# Altium schematic sheet ADCs.SchDoc: =ProjectTitle
size A3; Author: Jaime I. Chait; Organization: NWES LLC; Address1: 111 SW 5th Ave, STE 3150; Address2: Portland, OR 97204; SheetNumber: 1; SheetTotal: 1
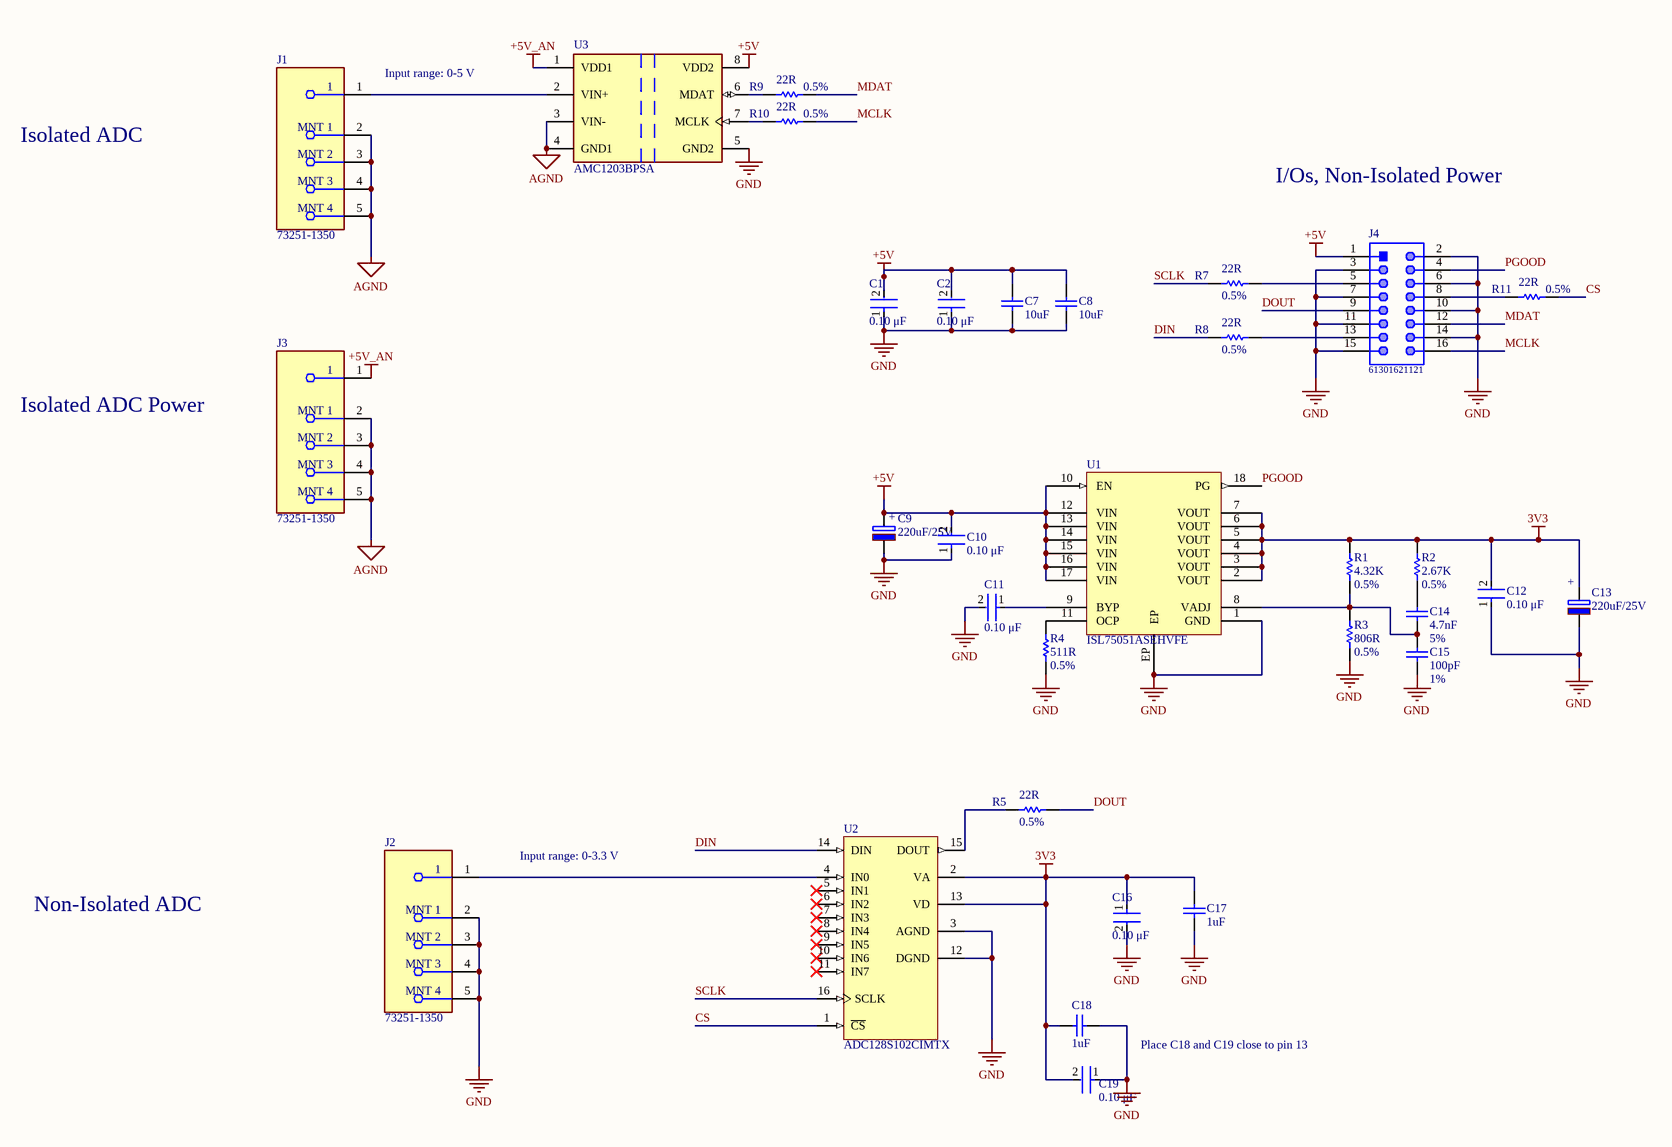
[diagram p0: ADCs.SchDoc]

## Parts
C1  0.10 μF  [FP-C0603C-CF-MFG]
C2  0.10 μF  [FP-C0603C-CF-MFG]
C7  10uF  [CAPC1608X90N]
C8  10uF  [CAPC1608X90N]
C9  220uF/25V  [CAP_AE830X1050N]
C10  0.10 μF  [FP-C0603C-CF-MFG]
C11  0.10 μF  [FP-C0603C-CF-MFG]
C12  0.10 μF  [FP-C0603C-CF-MFG]
C13  220uF/25V  [CAP_AE830X1050N]
C14  4.7nF  Tolerance: 5%  [CAPC1608X90N]
C15  100pF  Tolerance: 1%  [CAPC1608X90N]
C16  0.10 μF  [FP-C0603C-CF-MFG]
C17  1uF  [CAPC1608X90N]
C18  1uF  [CAPC1608X90N]
C19  0.10 μF  [FP-C0603C-CF-MFG]
J1  73251-1350  [FP-73251-1350-MFG]
J2  73251-1350  [FP-73251-1350-MFG]
J3  73251-1350  [FP-73251-1350-MFG]
J4  61301621121  [61301621121]
R1  4.32K  Tolerance: 0.5%  [RESC1608X55N]
R2  2.67K  Tolerance: 0.5%  [RESC1608X55N]
R3  806R  Tolerance: 0.5%  [RESC1608X55N]
R4  511R  Tolerance: 0.5%  [RESC1608X55N]
R5  22R  Tolerance: 0.5%  [RESC1608X55N]
R7  22R  Tolerance: 0.5%  [RESC1608X55N]
R8  22R  Tolerance: 0.5%  [RESC1608X55N]
R9  22R  Tolerance: 0.5%  [RESC1608X55N]
R10  22R  Tolerance: 0.5%  [RESC1608X55N]
R11  22R  Tolerance: 0.5%  [RESC1608X55N]
U1  ISL75051ASEHVFE  [CFP102P1520X310-18AN]
U2  ADC128S102CIMTX  [MTC16_N]
U3  AMC1203BPSA  [FP-PSA0008A-IPC_C]

## Nets
3V3: C12.2 C13.1 C16.1 C17.1 C18.2 C19.2 R1.2 R2.2 U1.2(VOUT) U1.3(VOUT) U1.4(VOUT) U1.5(VOUT) U1.6(VOUT) U1.7(VOUT) U2.2(VA) U2.13(VD)
+5V: C1.2 C2.2 C7.1 C8.1 C9.1 C10.2 J4.1 U1.10(EN) U1.12(VIN) U1.13(VIN) U1.14(VIN) U1.15(VIN) U1.16(VIN) U1.17(VIN) U3.8(VDD2)
+5V_AN: J3.1 U3.1(VDD1)
AGND: J1.2(MNT_1) J1.3(MNT_2) J1.4(MNT_3) J1.5(MNT_4) J3.2(MNT_1) J3.3(MNT_2) J3.4(MNT_3) J3.5(MNT_4) U3.3(VIN-) U3.4(GND1)
GND: C1.1 C2.1 C7.2 C8.2 C9.2 C10.1 C11.2 C12.1 C13.2 C15.2 C16.2 C17.2 C18.1 C19.1 J2.2(MNT_1) J2.3(MNT_2) J2.4(MNT_3) J2.5(MNT_4) J4.2 J4.3 J4.6 J4.7 J4.10 J4.11 J4.14 J4.15 R3.1 R4.1 U1.1(GND) U1.EP U2.3(AGND) U2.12(DGND) U3.5(GND2)
CS: R11.2 U2.1(~{CS})
DIN: R8.1 U2.14(DIN)
DOUT: J4.9 R5.2
MCLK: J4.16 R10.2
MDAT: J4.12 R9.2
PGOOD: J4.4 U1.18(PG)
SCLK: R7.1 U2.16(SCLK)
NetC11_1: C11.1 U1.9(BYP)
NetC14_1: C14.1 R2.1
NetC14_2: C14.2 C15.1 R1.1 R3.2 U1.8(VADJ)
NetJ1_1: J1.1 U3.2(VIN+)
NetJ2_1: J2.1 U2.4(IN0)
NetJ4_5: J4.5 R7.2
NetJ4_8: J4.8 R11.1
NetJ4_13: J4.13 R8.2
NetR4_2: R4.2 U1.11(OCP)
NetR5_1: R5.1 U2.15(DOUT)
NetR9_1: R9.1 U3.6(MDAT)
NetR10_1: R10.1 U3.7(MCLK)

Not connected (* = marked no-connect by the designer): U2 5(IN1)* 6(IN2)* 7(IN3)* 8(IN4)* 9(IN5)* 10(IN6)* 11(IN7)*

## Notes on the sheet
- (near J1) Input range: 0-5 V
- Isolated ADC
- I/Os, Non-Isolated Power
- Isolated ADC Power
- Non-Isolated ADC
- Input range: 0-3.3 V
- Place C18 and C19 close to pin 13
- Title
- Size:
- Date:
- A4
- Number:
- Time:
- Revision:
- Sheet
- of
- File:
- (in symbol CAP ALUM 220UF 20% 25V SMD) +

## Library data of the parts
C1 C2 C10-C12 C16 C19 = CMP-2006-03056-2: CAP CER 0.1UF 50V 5% X7R 0603; Manufacturer Part Number: C0603C104J5RACTU; Manufacturer: KEMET; Tolerance: 0.05; Automotive Grade: Grade 1; Material: Ceramic; Temperature Coefficient: 30ppm/°C; Value: 0.10 μF; Package: C0603C-CF; Height: 0.87mm; ComponentLink2Description: Datasheet; Voltage Rating: 50 V; Digikey Description: CAP CER 0.1UF 50V 5% X7R 0603; Temperature Range High: +125°C; Device Class L2: Capacitors; Capacitance: 0.10 μF; Octopart: https://octopart.com/c0603c104j5ractu-kemet-10440638; RoHS: TRUE; Mouser Description: Multilayer Ceramic Capacitors MLCC - SMD/SMT 50volts 0.1uF X7R 5%; Temperature Range Low: -55°C; Automotive: Yes; Lead Free: Yes; ComponentLink2URL: https://api.kemet.com/component-edge/download/datasheet/C0603C100J5GACAUTO.pdf; Device Class L3: Ceramic Capacitors; Category: Cap; Temperature: -55°C to +125°C; Temperature Characteristic: X7R; Device Class L1: Passive Components
C7 C8 = CAP CER 10UF 25V X5R 0603: Manufacturer Part Number: GRM188R61E106KA73D; Manufacturer: Murata Electronics; Tolerance: ±10%; Supplier Part Number 1: 490-18214-1-ND; Package: 0603; value: 10uF; Supplier 1: Digi-Key; Height: 1mm; ComponentLink1Description: New link; ComponentLink1URL: *; Voltage - Rated: 25V
C9 C13 = CAP ALUM 220UF 20% 25V SMD: Manufacturer Part Number: EMZA250ADA221MHA0G; Manufacturer: United Chemi-Con; Supplier Part Number 1: 565-2550-1-ND; value: 220uF/25V; Supplier 1: Digi-Key; Height: 10.5mm; ComponentLink1Description: New link; ComponentLink1URL: *; Tolerance: ±20%
C14 = CAP CER 4700PF 50V C0G 0603: Manufacturer Part Number: CGA3E2C0G1H472J080AA; Manufacturer: TDK Corporation; Supplier Part Number 1: 445-6912-1-ND; Package: 0603; value: 4.7nF; Supplier 1: Digi-Key; Height: 0.9mm; ComponentLink1Description: New link; ComponentLink1URL: *; Voltage - Rated: 50V
C15 = CAP CER 100PF 50V C0G/NP0 0603: Manufacturer Part Number: 06035A101FAT2A; Manufacturer: KYOCERA AVX; Supplier Part Number 1: 478-6202-1-ND; Package: 0603; value: 100pF; Supplier 1: Digi-Key; Height: 0.9mm; ComponentLink1Description: New link; ComponentLink1URL: *; Voltage - Rated: 50V
C17 C18 = CAP CER 1UF 25V X7R 0603: Manufacturer Part Number: GCM188R71E105KA64D; Manufacturer: Murata Electronics; Tolerance: ±10%; Supplier Part Number 1: 490-10673-1-ND; Package: 0603; value: 1uF; Supplier 1: Digi-Key; Height: 0.9mm; ComponentLink1Description: New link; ComponentLink1URL: *; Voltage - Rated: 25V
J1-J3 = CMP-04764-000006-1: CONN SMA JACK STR 50 OHM SMD; Manufacturer: Molex; Is Female: yes; Standoff Height: 0.41mm; Impedance: 50Ω; Number Of Contacts: 1; Conn Orientation: Straight; Voltage Rating: 500V; Shielding: true; Frequency: 18GHz; Package: 73251-1350; Device Class L1: Connectors; Category: Conn; Manufacturer Part Number: 73251-1350; ComponentLink2URL: https://www.molex.com/pdm_docs/sd/732511350_sd.pdf; Automotive: No; Height: 9.655mm; Octopart: https://octopart.com/73251-1350-molex-5414390; Footprint Url: https://forum.upverter.com/uploads/default/original/3X/d/a/daeafa2ce4908d4fc4e49f0b17d7d2c986fce444.pdf; Temperature Range High: +165°C; Device Class L3: unset; Mouser Description: RF Connectors / Coaxial Connectors SMA ST PCB-JCK STD SMT; Lead Free: Yes; Temperature: -65°C to +165°C; RoHS: TRUE; ComponentLink2Description: Datasheet; Device Class L2: RF / Coaxial Connectors; Digikey Description: CONN SMA JACK STR 50 OHM SMD; Contact Material: Gold; Temperature Range Low: -65°C
J4 = CMP-1502-01097-1: THT Vertical Pin Header WR-PHD, Pitch 2.54 mm, Dual Row, 16 pins; Manufacturer: Wurth Elektronik; Gender: Male; Rated Current: 3A; Pitch: 2.54mm; Withstanding Voltage: 500VAC; Contact Resistance: 20mOhm; Working Voltage: 250VAC; Pin Number: 16; Mounting Technology: THT; Orientation: Vertical; Manufacturer URL: http://www.we-online.de; Row Number: Dual; Part Number: 61301621121; Datasheet URL: https://katalog.we-online.de/em/datasheet/6130xx21121.pdf; Packaging: Bag; Operating Temperature: -40to105degC; Publisher: WurthElektronik; Package Reference: 61301621121
R1 = RES SMD 4.32K OHM 0.5% 1/5W 0603: Manufacturer: Panasonic Electronic Components; Manufacturer Part Number: ERJ-PB3D4321V; Supplier Part Number 1: P20355CT-ND; Package: 0603; Height: 0.55mm; Supplier 1: Digi-Key; value: 4.32K
R2 = RES SMD 2.67KOHM 0.5% 1/10W 0603: Manufacturer: Yageo; Manufacturer Part Number: RT0603DRD072K67L; Supplier Part Number 1: 311-2.67KDCT-ND; Package: 0603; Height: 0.55mm; Supplier 1: Digi-Key; value: 2.67K
R3 = RES SMD 806 OHM 0.5% 1/10W 0603: Manufacturer: Yageo; Manufacturer Part Number: RT0603DRD0762KL; Supplier Part Number 1: 311-806DCT-ND; Package: 0603; Height: 0.55mm; Supplier 1: Digi-Key; value: 806R
R4 = RES SMD 511 OHM 1% 1/10W 0603: Manufacturer: Panasonic Electronic Components; Manufacturer Part Number: ERJ-3EKF5110V; Supplier Part Number 1: P511HCT-ND; Package: 0603; Height: 0.55mm; Supplier 1: Digi-Key; value: 511R
R5 R7-R11 = RES SMD 22 OHM 0.5% 1/10W 0603: Manufacturer: Yageo; Manufacturer Part Number: RT0603DRD0722RL; Supplier Part Number 1: 13-RT0603DRD0722RLCT-ND; Package: 0603; Height: 0.55mm; Supplier 1: Digi-Key; value: 22R
U1 = ISL75051ASEHVFE: Voltage regulator, linear, variable, 3 A, CFP-18 exposed pad, class V; Manufacturer: Renesas / Intersil; FM (SMD) Part Number: 5962R1121203VYC; EM Part Number: ISL75051ASEHFE/PROTO; Output Voltage: 0.8 - 5.0V; TID: 50krad (LDR), 100krad (HDR); Output Current Max: 3A; SEL: 86.3MeV*cm2/mg; Input Voltage High: 6V; Mass: 1.07g; Input Voltage Low: 2.2V; Lead Form: Yes; Manufacturer Part Number: ISL75051ASEHVFE; ComponentLink2URL: https://landandmaritimeapps.dla.mil/downloads/milspec/smd/11212.pdf; ComponentLink1URL: https://www.renesas.com/us/en/www/doc/datasheet/isl75051aseh-3051aseh.pdf; Package: CFP-18 (exposed pad); Mount Type: SMT; Distributor: Avnet; ComponentLink1Description: Datasheet - Manufacturer; ComponentLink2Description: Datasheet - Mil Spec; Device Class: V; Supplier Part Number 1: ISL75051ASEHVFE; Supplier 1: Renesas / Intersil
U2 = CMP-0054-00337-2: 8-Channel, 500 kSPS to 1 MSPS, 12-Bit A/D Converter, 16-pin TSSOP; Manufacturer: National Semiconductor; PackageTopMarking: NSUZXYTT*128S102*CIMT; CompType: ADC IC; PowerWise: Y; Code_JEDEC: MO-153-AB; DatasheetVersion: Jul-2009; PackageReference: MTC16; ComponentLink3URL: http://www.national.com/packaging/folders/mtc16.html; PinCount: 16; ComponentLink1URL: http://www.national.com/ds/AD/ADC128S102.pdf; PackageVersion: revD, Jun-2003; RevisionNote: Component URLs added; ComponentLink2URL: http://www.national.com/pf/AD/ADC128S102.html; PackageDescription: Molded TSSOP, Jedec, 5 x 4.4 x 0.9mm Body, 16 Lead, 0.65mm Pitch; ComponentLink1Description: ADC128S102 Datasheet; ComponentLink3Description: MTC16 Package Page; RoHS: N; ComponentLink2Description: ADC128S102 Web Page
U3 = CMP-04860-000036-1: IC ADC 16BIT SIGMA-DELTA 8SOP; Input Type: DIFFERENTIAL; Min Supply Voltage: 4.5V; Max Power Dissipation: 110mW; Supply Type: Analog; Operating Supply Voltage: 5V; Number of Channels: 1; Number of Bits: 16; Power Consumption: 80mW; Interface: Serial; Differential Nonlinearity: 1LSB; Signal to Noise Ratio (SNR): 85dB; Resolution: 16b; Max Supply Voltage: 5.5V; Integral Nonlinearity (INL): 6LSB; Polarity: Bipolar; Sampling Rate: 40KS/s; Lead Free: Lead Free; Case/Package: SOP; Number of Pins: 8; Packaging: Rail/Tube; Mount: Surface Mount; Package Quantity: 95; RoHS Compliant: Yes; Number of Converters: 1; Min Operating Temperature: -40°C; Number of Analog Inputs: 1; Max Operating Temperature: 105°C; Number of Elements: 1; Contact Plating: Gold; Power Dissipation: 80mW; Number of A/D Converters: 1; Number of Inputs: 1